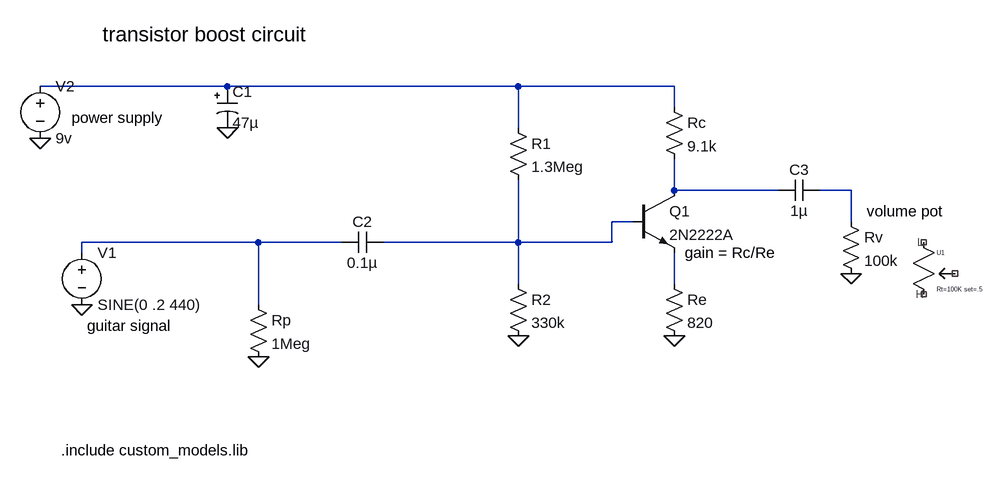
[diagram p0: schematic Draft3.asc]
Draft3.asc, the LTspice schematic file:
Version 4
SHEET 1 1380 680
WIRE 208 -128 -80 -128
WIRE 656 -128 208 -128
WIRE 896 -128 656 -128
WIRE 896 -96 896 -128
WIRE 656 -64 656 -128
WIRE 896 32 896 -16
WIRE 1056 32 896 32
WIRE 1168 32 1120 32
WIRE 832 80 800 80
WIRE 1168 80 1168 32
WIRE 256 112 -16 112
WIRE 384 112 256 112
WIRE 656 112 656 16
WIRE 656 112 448 112
WIRE 800 112 800 80
WIRE 800 112 656 112
WIRE -16 128 -16 112
WIRE 656 176 656 112
WIRE 896 176 896 128
WIRE 256 208 256 112
FLAG 208 -64 0
FLAG -80 -48 0
FLAG -16 208 0
FLAG 256 288 0
FLAG 656 256 0
FLAG 896 256 0
FLAG 1168 160 0
SYMBOL voltage -16 112 R0
WINDOW 123 0 0 Left 0
WINDOW 39 0 0 Left 0
SYMATTR InstName V1
SYMATTR Value SINE(0 .2 440)
SYMBOL res 240 192 R0
SYMATTR InstName Rp
SYMATTR Value 1Meg
SYMBOL res 640 -80 R0
SYMATTR InstName R1
SYMATTR Value 1.3Meg
SYMBOL res 640 160 R0
SYMATTR InstName R2
SYMATTR Value 330k
SYMBOL res 880 160 R0
SYMATTR InstName Re
SYMATTR Value 820
SYMBOL res 880 -112 R0
SYMATTR InstName Rc
SYMATTR Value 9.1k
SYMBOL res 1152 64 R0
SYMATTR InstName Rv
SYMATTR Value 100k
SYMBOL cap 448 96 R90
WINDOW 0 0 32 VBottom 2
WINDOW 3 32 32 VTop 2
SYMATTR InstName C2
SYMATTR Value 0.1µ
SYMBOL cap 1120 16 R90
WINDOW 0 0 32 VBottom 2
WINDOW 3 32 32 VTop 2
SYMATTR InstName C3
SYMATTR Value 1µ
SYMBOL npn 832 32 R0
SYMATTR InstName Q1
SYMATTR Value 2N2222A
SYMBOL polcap 192 -128 R0
SYMATTR InstName C1
SYMATTR Value 47µ
SYMBOL voltage -80 -144 R0
WINDOW 123 0 0 Left 0
WINDOW 39 0 0 Left 0
SYMATTR InstName V2
SYMATTR Value 9v
SYMBOL pot 1264 96 R0
SYMATTR InstName U1
SYMATTR Value Rt=100K set=.5
TEXT -48 432 Left 2 !.include custom_models.lib
TEXT 16 -208 Left 3 !transistor boost circuit
TEXT -8 240 Left 2 !guitar signal
TEXT -32 -80 Left 2 !power supply
TEXT 1192 64 Left 2 !volume pot
TEXT 912 128 Left 2 !gain = Rc/Re

The netlist it stands for:
* Draft3.asc
V1 N005 0 SINE(0 .2 440)
Rp N005 0 1Meg
R1 N001 N004 1.3Meg
R2 N004 0 330k
Re N006 0 820
Rc N001 N002 9.1k
Rv N003 0 100k
C2 N004 N005 0.1µ
C3 N003 N002 1µ
Q1 N002 N004 N006 0 2N2222A
C1 N001 0 47µ
V2 N001 0 9v
XU1 NC_01 NC_02 NC_03 potentiometer Rt=100K set=.5  ; pins H L 3
.model NPN NPN
.model PNP PNP
.lib standard.bjt
.include custom_models.lib
transistor boost circuit
guitar signal
power supply
volume pot
gain = Rc/Re
.lib pote.lib
.backanno
.end